# EAGLE design DoorchimeCR2 (EAGLE 6.5.0)

## Sheet 1 of 3
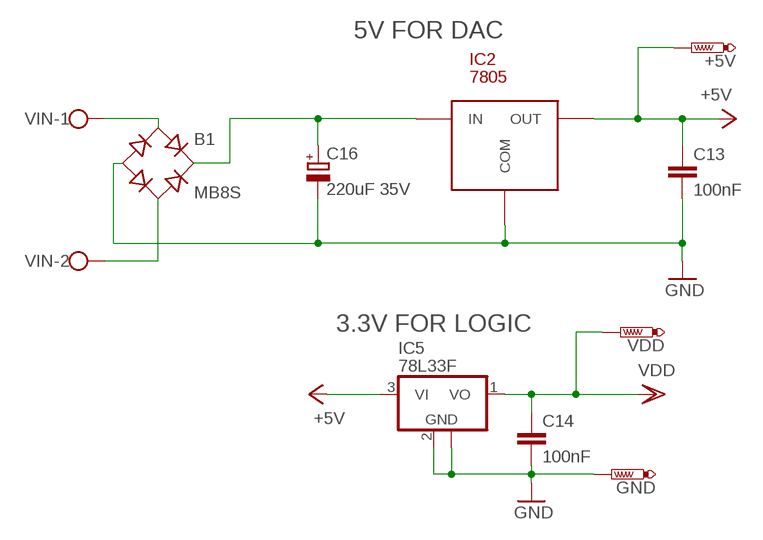
[diagram p0: schematic, sheet 1]

### Parts
+5V  PTR1TP15R  [TP15R]
B1  MB8S  [SOIC-4]
C13  100nF  C-EUC0603  [C0603]
C14  100nF  C-EUC0603  [C0603]
C16  220uF 35V  CPOL-EU153CLV-0807  [153CLV-0807]
GND  PTR1TP15R  [TP15R]
IC2  7805  78XX-D2PAK  [D2PAK]
IC5  78L33F  78L05F  [SOT89]
VDD  PTR1TP15R  [TP15R]
VIN  W237-102  [W237-102]

### Nets
+5V: +5V.TP C13.1 IC2.OUT IC5.3(VI) ; also sheet 3
GND [analog_pwr]: B1.- C13.2 C14.2 C16.- GND.TP IC2.COM IC5.2(GND) IC5.2@1(GND) ; also sheet 2,3
VDD: C14.1 IC5.1(VO) VDD.TP ; also sheet 2
VIN1 [system_pwr]: B1.~1(AC1) VIN.1
VIN2: B1.~2(AC2) VIN.2
VIN+: B1.+ C16.+ IC2.IN

### Notes on the sheet
- 5V FOR DAC
- 3.3V FOR LOGIC

## Sheet 2 of 3: Logic
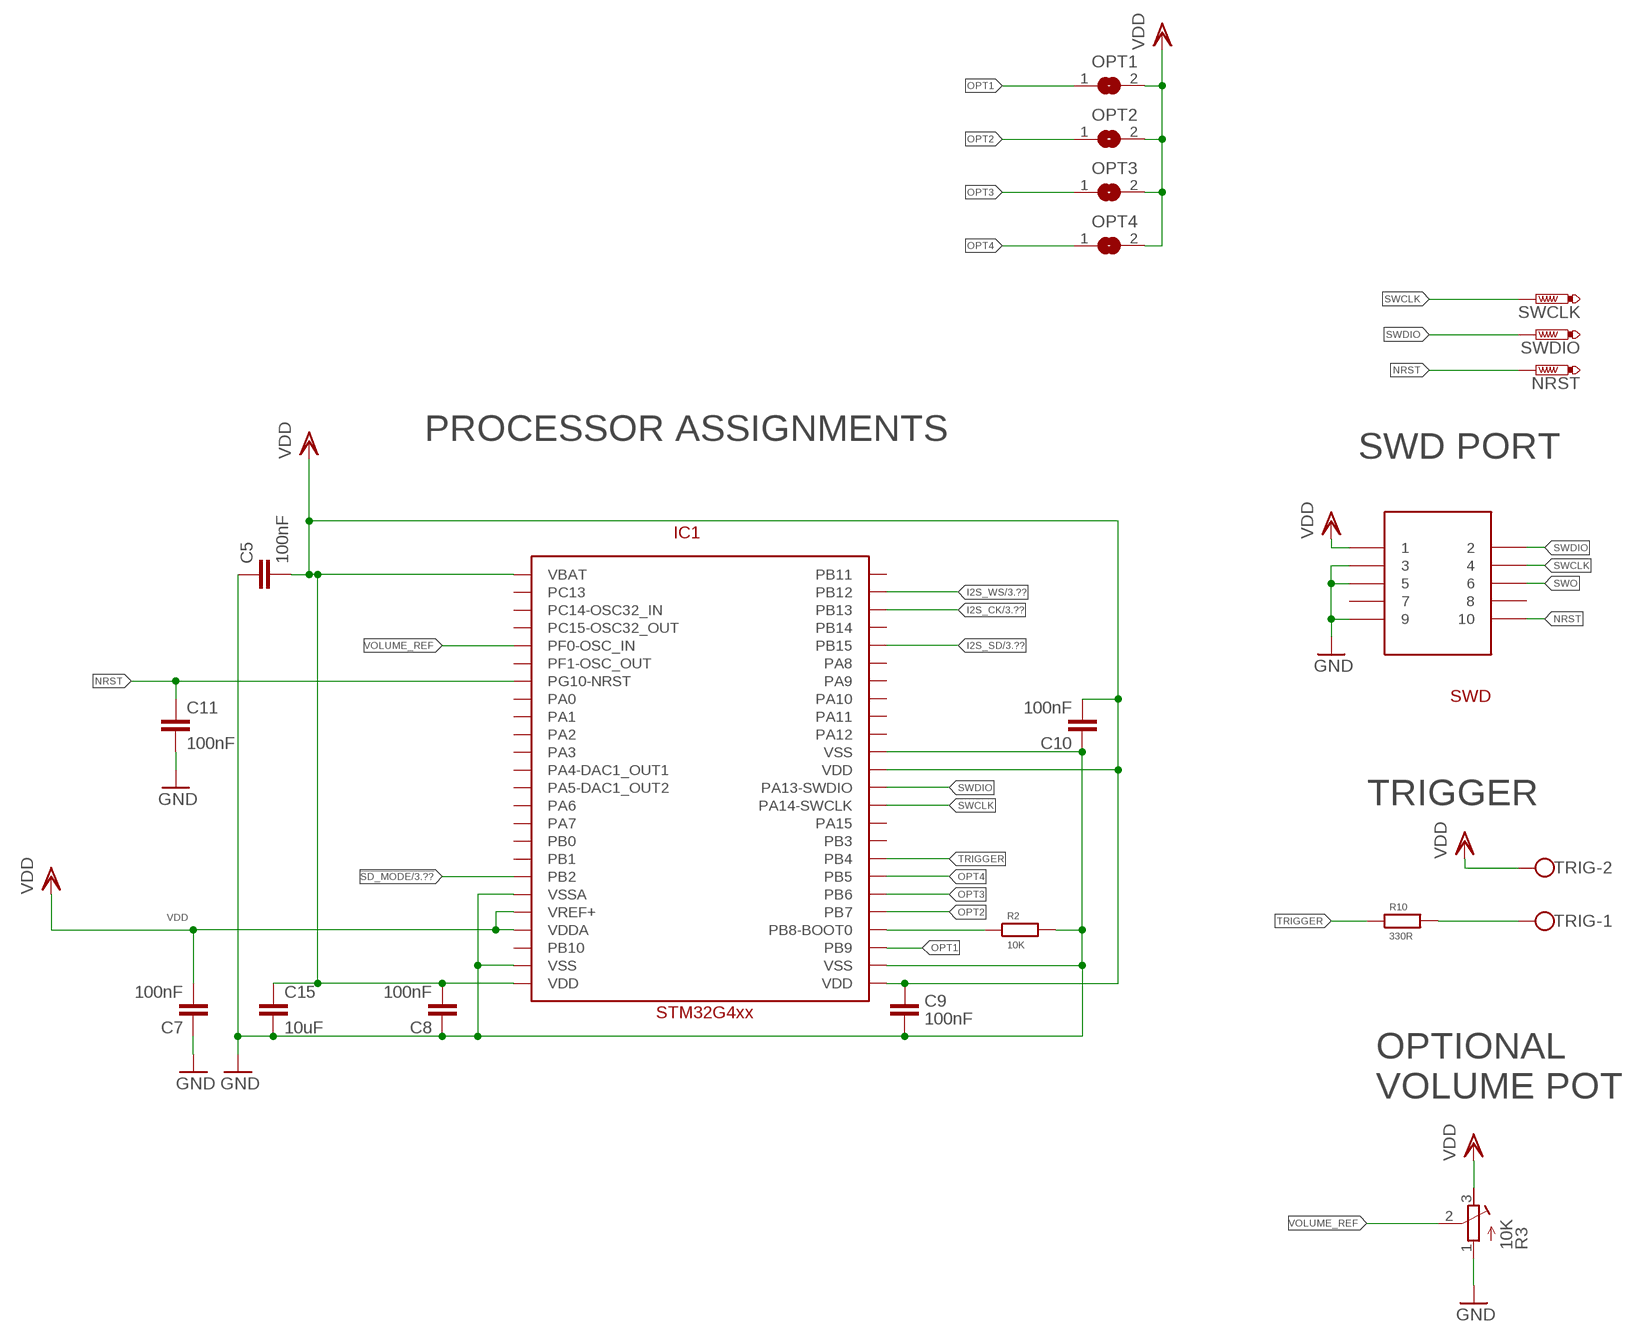
[diagram p1: schematic, sheet 2]

### Parts
C5  100nF  C-EUC0603  [C0603]
C7  100nF  C-EUC0603  [C0603]
C8  100nF  C-EUC0603  [C0603]
C9  100nF  C-EUC0603  [C0603]
C10  100nF  C-EUC0603  [C0603]
C11  100nF  C-EUC0603  [C0603]
C15  10uF  C-EUC0603  [C0603]
IC1  STM32G4xx  STM32G431-C8T6  [TQFP48]
NRST  PTR1TP15R  [TP15R]
OPT1  SJ  [SJ]
OPT2  SJ  [SJ]
OPT3  SJ  [SJ]
OPT4  SJ  [SJ]
R2  10K  R-EU_R0603  [R0603]
R3  10K  R-TRIMM3339P  [RTRIM3339P]
R10  330R  R-EU_R0603  [R0603]
SWCLK  PTR1TP15R  [TP15R]
SWD  FTSH-105-01  [FTSH-105-01-XXX-DV-K]
SWDIO  PTR1TP15R  [TP15R]
TRIG  W237-102  [W237-102]

### Nets
!SD_MODE: IC1.PB2 ; also sheet 3
BOOT0: IC1.PB8-BOOT0 R2.1
GND [analog_pwr]: C5.1 C7.1 C8.1 C9.1 C10.1 C11.2 C15.2 IC1.VSS@23(VSS) IC1.VSS@35(VSS) IC1.VSS@47(VSS) IC1.VSSA R2.2 R3.1(E) SWD.3 SWD.5 SWD.9 ; also sheet 1,3
I2S_CK: IC1.PB13 ; also sheet 3
I2S_SD: IC1.PB15 ; also sheet 3
I2S_WS: IC1.PB12 ; also sheet 3
NRST: C11.1 IC1.PG10-NRST NRST.TP SWD.10
OPT1: IC1.PB9 OPT1.1
OPT2: IC1.PB7 OPT2.1
OPT3: IC1.PB6 OPT3.1
OPT4: IC1.PB5 OPT4.1
SWCLK: IC1.PA14-SWCLK SWCLK.TP SWD.4
SWDIO: IC1.PA13-SWDIO SWD.2 SWDIO.TP
SWO: SWD.6
TRIG1: R10.2 TRIG.1
TRIGGER: IC1.PB4 R10.1
VDD: C5.2 C7.2 C8.2 C9.2 C10.2 C15.1 IC1.VBAT IC1.VDD@24(VDD) IC1.VDD@36(VDD) IC1.VDD@48(VDD) IC1.VDDA IC1.VREF+ OPT1.2 OPT2.2 OPT3.2 OPT4.2 R3.3(A) SWD.1 TRIG.2 ; also sheet 1
VOLUME_REF: IC1.PF0-OSC_IN R3.2(S)
Unconnected: IC1.PA0 IC1.PA1 IC1.PA2 IC1.PA3 IC1.PA4-DAC1_OUT1 IC1.PA5-DAC1_OUT2 IC1.PA6 IC1.PA7 IC1.PA8 IC1.PA9 IC1.PA10 IC1.PA11 IC1.PA12 IC1.PA15 IC1.PB0 IC1.PB1 IC1.PB3 IC1.PB10 IC1.PB11 IC1.PB14 IC1.PC13 IC1.PC14-OSC32_IN IC1.PC15-OSC32_OUT IC1.PF1-OSC_OUT SWD.7 SWD.8

### Notes on the sheet
- PROCESSOR ASSIGNMENTS
- SWD PORT
- TRIGGER
- OPTIONAL
  VOLUME POT

## Sheet 3 of 3: Speaker Output
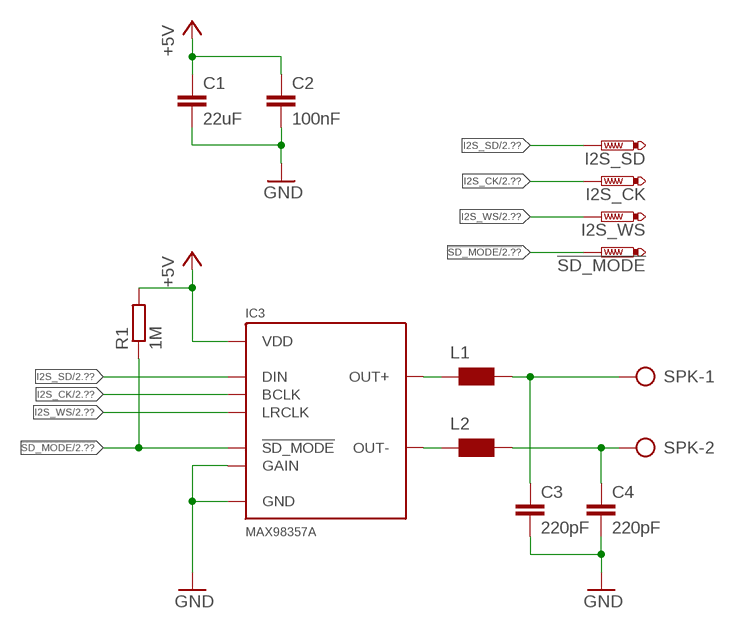
[diagram p2: schematic, sheet 3]

### Parts
!SD_MODE  PTR1TP15R  [TP15R]
C1  22uF  C-EUC0603  [C0603]
C2  100nF  C-EUC0603  [C0603]
C3  220pF  C-EUC0603  [C0603]
C4  220pF  C-EUC0603  [C0603]
I2S_CK  PTR1TP15R  [TP15R]
I2S_SD  PTR1TP15R  [TP15R]
I2S_WS  PTR1TP15R  [TP15R]
IC3  MAX98357A  [TQFN-16]
L1  WE-CBF_0603  [0603]
L2  WE-CBF_0603  [0603]
R1  1M  R-EU_R0603  [R0603]
SPK  W237-102  [W237-102]

### Nets
!SD_MODE: !SD_MODE.TP IC3.P$4(!SD_MODE) R1.1 ; also sheet 2
+5V: C1.1 C2.1 IC3.P$7(VDD) IC3.P$8(VDD) R1.2 ; also sheet 1
GND [analog_pwr]: C1.2 C2.2 C3.2 C4.2 IC3.P$2(GAIN) IC3.P$3(GND) IC3.P$11(GND) IC3.P$15(GND) IC3.P$EP(GND) ; also sheet 1,2
I2S_CK: I2S_CK.TP IC3.P$16(BCLK) ; also sheet 2
I2S_SD: I2S_SD.TP IC3.P$1(DIN) ; also sheet 2
I2S_WS: I2S_WS.TP IC3.P$14(LRCLK) ; also sheet 2
N$1 [system_pwr]: IC3.P$9(OUT+) L1.1
N$2 [system_pwr]: IC3.P$10(OUT-) L2.1
N$3 [system_pwr]: C4.1 L2.2 SPK.2
N$4 [system_pwr]: C3.1 L1.2 SPK.1

## Library data of the parts
!SD_MODE +5V GND I2S_CK I2S_SD I2S_WS NRST SWCLK SWDIO VDD = testpad:PTR1: TEST PIN
B1 = rectifier:MB*S: Bridge Rectifier Source: http://www.fairchildsemi.com/ds/MB/MB6S.pdf
C1-C5 C7-C11 C13-C15 = rcl:C-EU: CAPACITOR, European symbol
C16 = rcl:CPOL-EU: POLARIZED CAPACITOR, European symbol
IC1 = STM32G431:STM32G431-C8T6: STM32G431C8T6 64K of FLASH, 32K or RAM, 170MHz Cortex M4 with single precision floating point unit. Also, Two DACs.
IC2 = 78XXCD2T:78XX-D2PAK
IC3 = SparkFun-IC-Amplifiers:MAX98357A: I2S DAC 3.2W (4-8ohm); PROD_ID: IC-14032
IC5 = linear:78L*: POSITOIV-VOLTAGE REGULATORS Output up to 100 mA Source: http://focus.ti.com/lit/ds/symlink/ua78l05.pdf
L1 L2 = wuerth-elektronik:WE-CBF: SMD EMI Suppression Ferrite Beads - excellent anti-EMI properties - low DCR - impedances till 3000 ohms - rated current up to 6 A
OPT1-OPT4 = jumper:SJ: SMD solder JUMPER
R1 R2 R10 = rcl:R-EU_: RESISTOR, European symbol
R3 = rcl:R-TRIMM: Trimm resistor
SPK TRIG VIN = con-wago-500:W237-102: WAGO SCREW CLAMP; MPN: 237-102; OC_FARNELL: unknown; OC_NEWARK: 70K9898
SWD = Con-Samtech (Duncs):FTSH-105-01

## Net classes
0 sgnal: width 0.152 mm, clearance 0.152 mm
1 analog_pwr: width 0.152 mm, clearance 0.152 mm
2 analog_sig: width 0.152 mm, clearance 0.152 mm
3 system_pwr: width 0.152 mm, clearance 0.152 mm

## Board
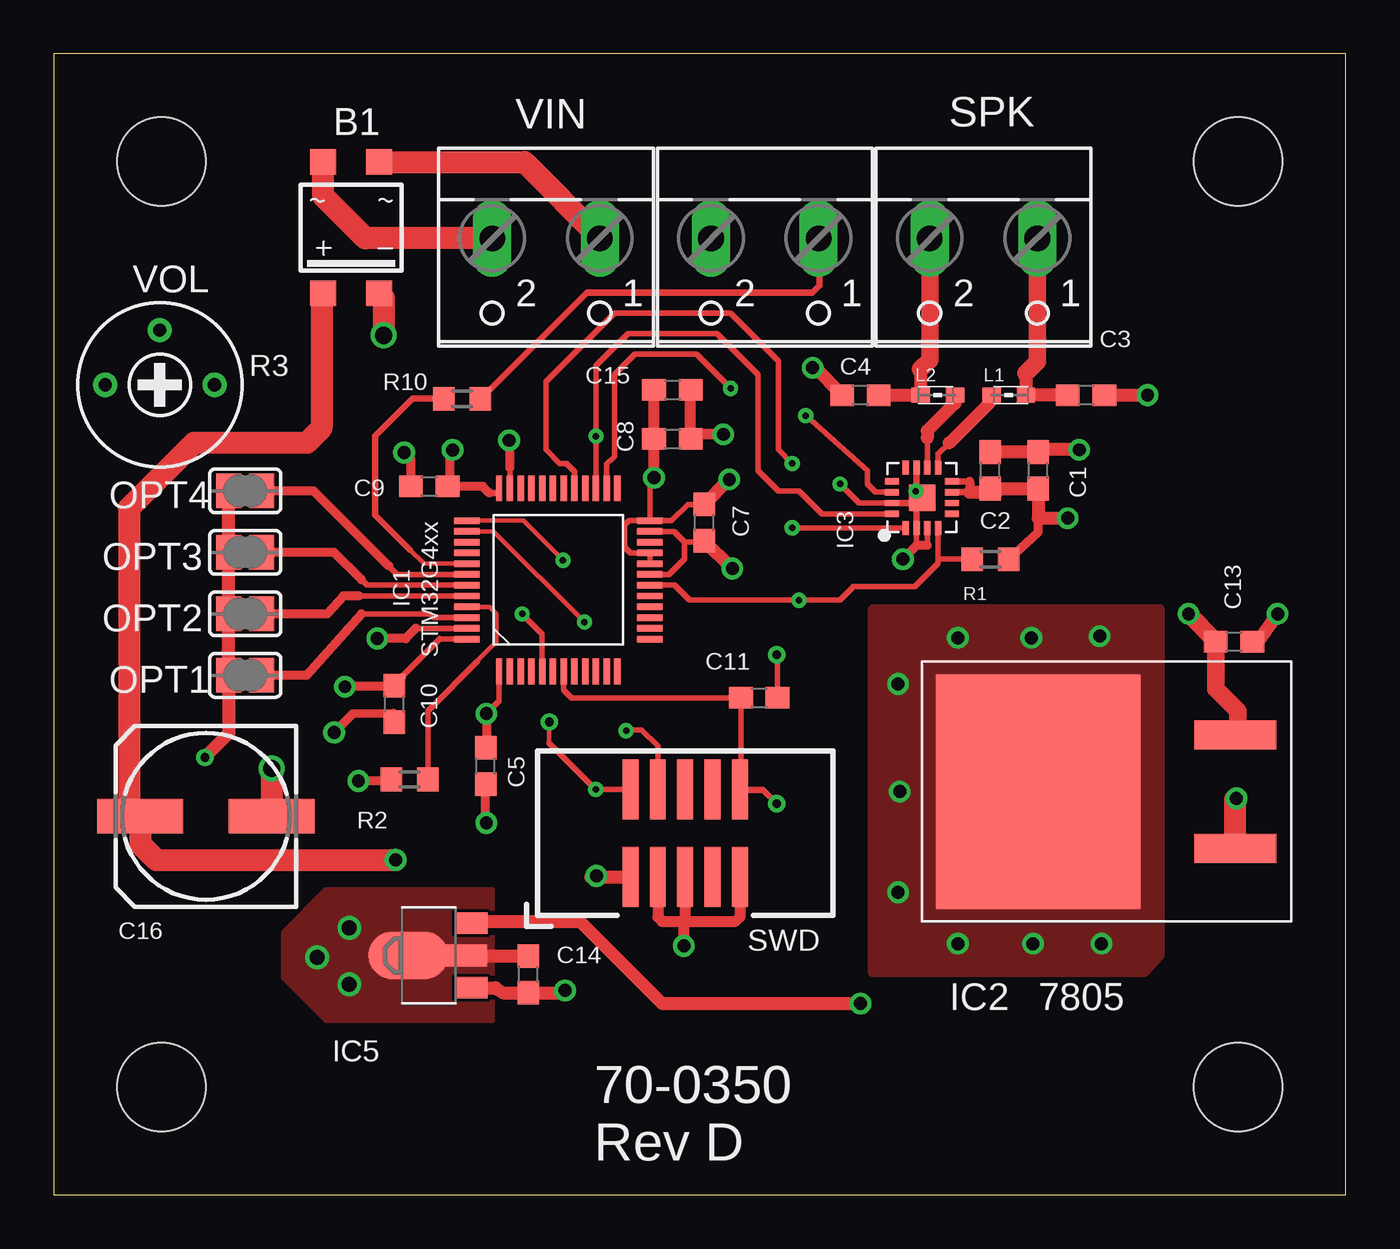
[diagram p3: board, top side]
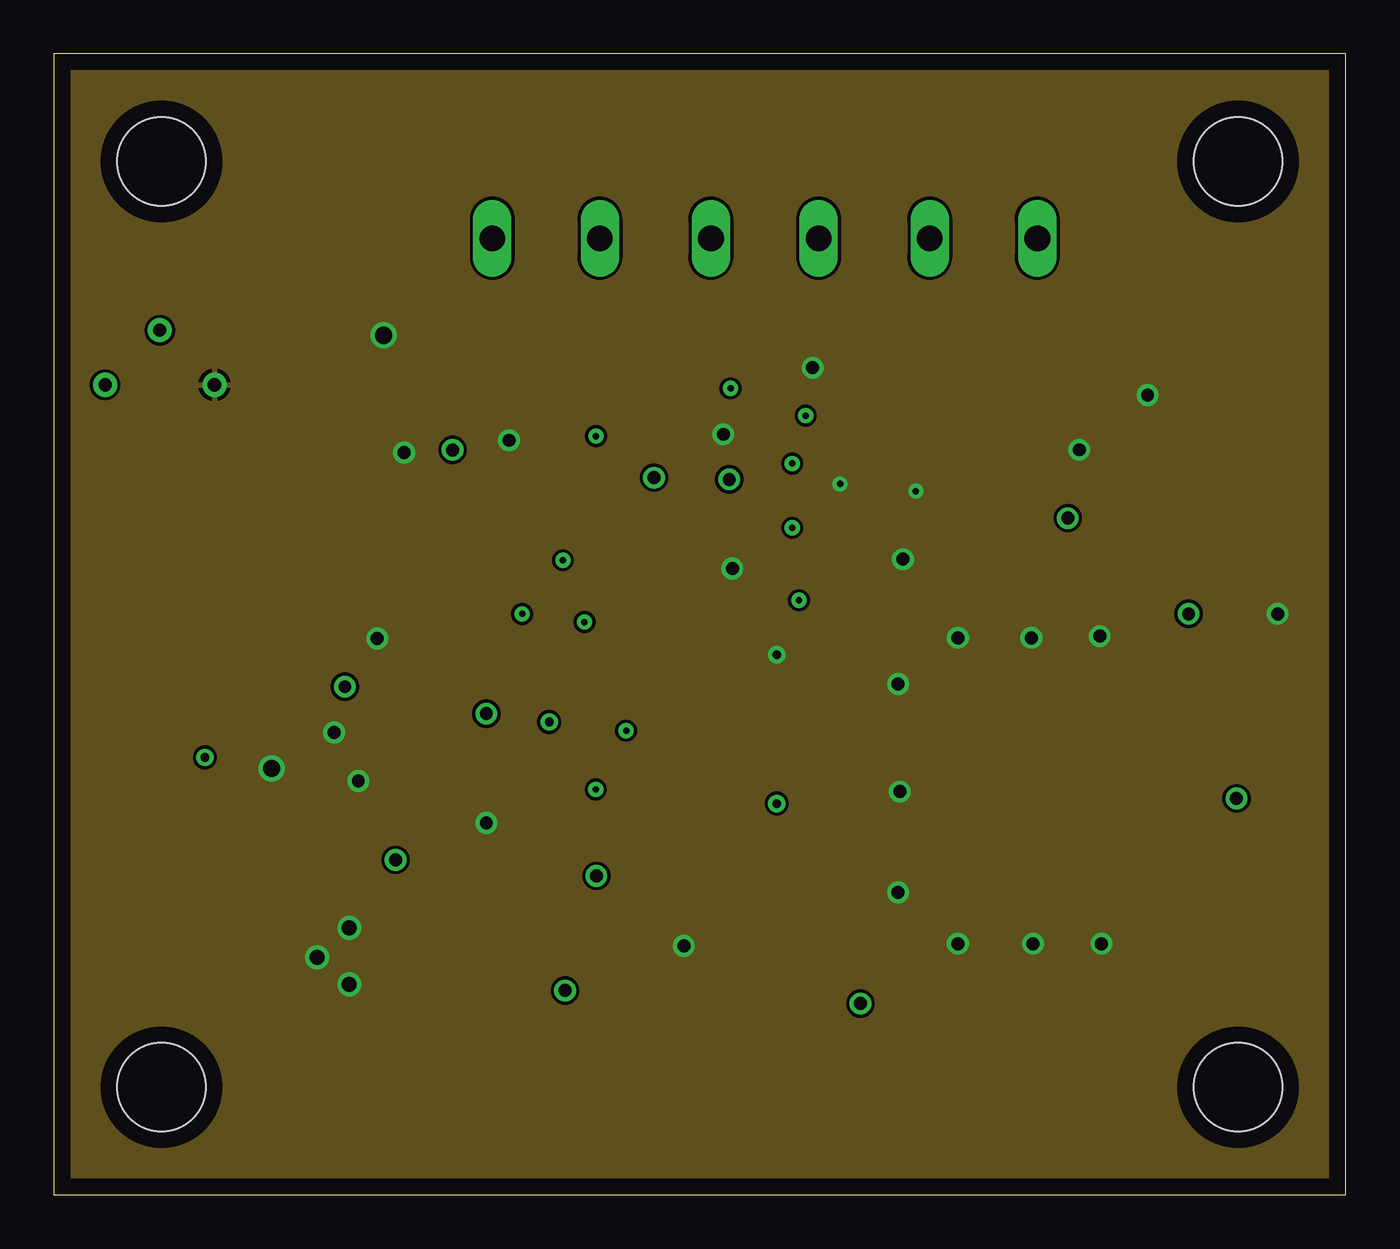
[diagram p4: board, inner layer Route2]
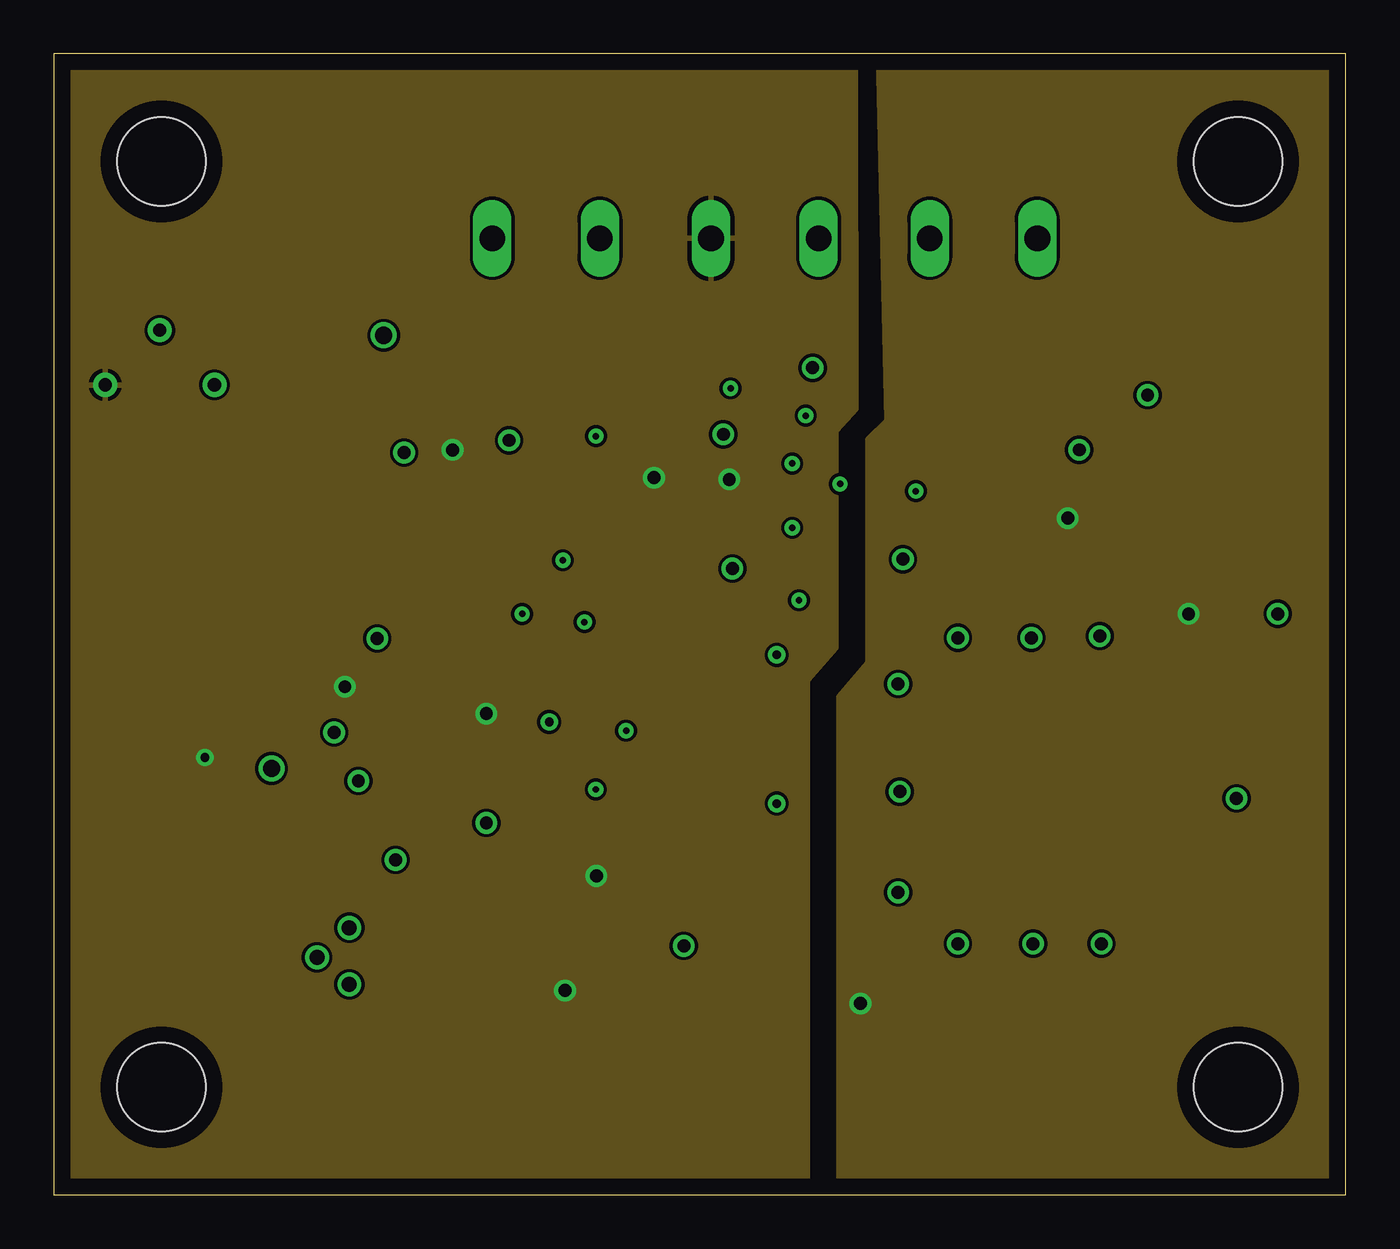
[diagram p5: board, inner layer Route15]
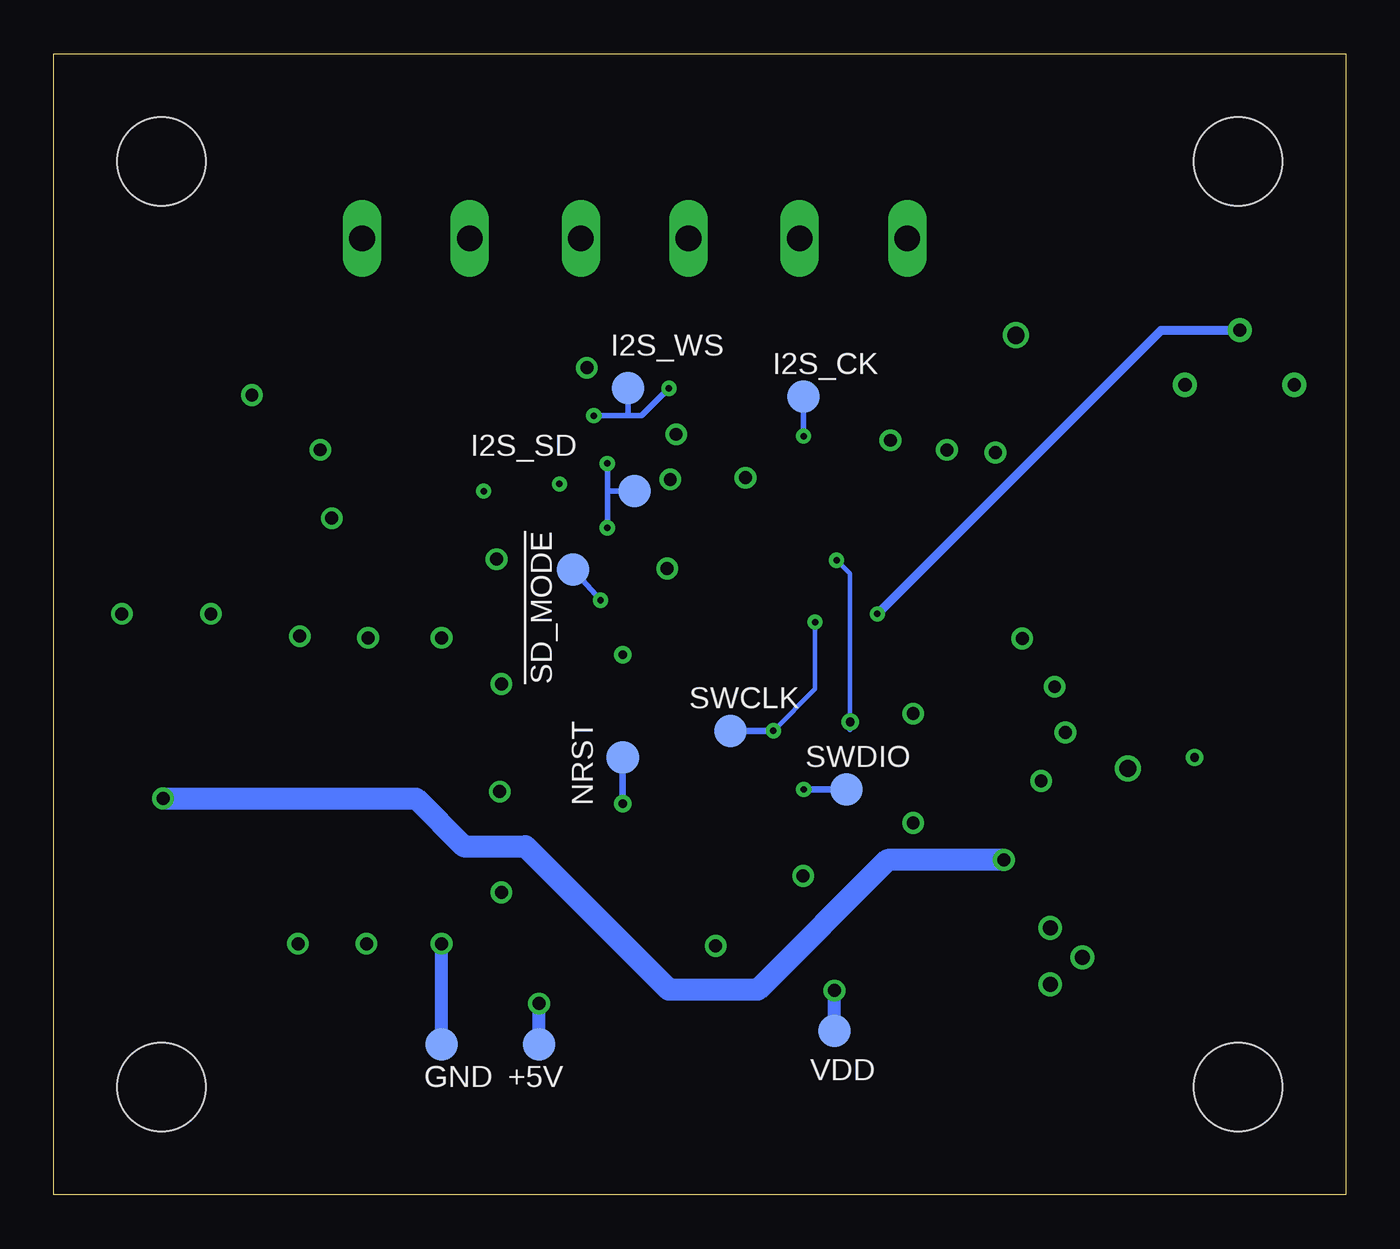
[diagram p6: board, bottom side, seen from below]

Size 60 x 53 mm. Coordinates in mm from the lower left corner, seen from the top.
Outline: 0,0 60,0 60,53 0,53 0,0
Copper layers ((1+2)*(15+16)): Top 0.035mm / dielectric 0.78mm / Route2 0.035mm / dielectric 0.1mm / Route15 0.035mm / dielectric 0.78mm / Bottom 0.035mm
Design rules "default *": minimum track width 6mil, minimum drill 0.25mm, track to track 3mil, track to pad 3mil, pad to pad 3mil, via to via 3mil, smd to smd 3mil, copper to edge 30mil, drill to drill 8mil, minimum pad ring 10mil, minimum via ring 8mil, stop-mask expansion 2.5mil, vias tented up to drill 0mil, thermal gap 8mil
Holes 4.1 mm at 5,5 55,5 55,48 5,48

### Footprints (pad centres in the part's own frame; a part is rotated, then mirrored left to right if it is on the bottom)
TP15R = smd 1.5 x 1.5: TP 0,0
SOIC-4 = smd 1.2 x 1.2: + 1.3,3.05; - -1.3,3.05; ~1 -1.3,-3.05; ~2 1.3,-3.05
C0603 = smd 1.1 x 1: 1 -0.85,0; 2 0.85,0
153CLV-0807 = smd 4 x 1.6: + 3.05,0; - -3.05,0
TQFP48 = smd 1.2 x 0.3: PA0 -4.25,-0.75; PA1 -4.25,-1.25; PA2 -4.25,-1.75; PA3 -4.25,-2.25; PA4-DAC1_OUT1 -4.25,-2.75; PA8 4.25,-0.25; PA9 4.25,0.25; PA10 4.25,0.75; PA11 4.25,1.25; PA12 4.25,1.75; PB11 4.25,-2.75; PB12 4.25,-2.25; PB13 4.25,-1.75; PB14 4.25,-1.25; PB15 4.25,-0.75; PC13 -4.25,2.25; PC14-OSC32_IN -4.25,1.75; PC15-OSC32_OUT -4.25,1.25; PF0-OSC_IN -4.25,0.75; PF1-OSC_OUT -4.25,0.25; PG10-NRST -4.25,-0.25; VBAT -4.25,2.75; VDD@36 4.25,2.75; VSS@35 4.25,2.25 | smd 0.3 x 1.2: PA5-DAC1_OUT2 -2.75,-4.25; PA6 -2.25,-4.25; PA7 -1.75,-4.25; PA13-SWDIO 2.75,4.25; PA14-SWCLK 2.25,4.25; PA15 1.75,4.25; PB0 -1.25,-4.25; PB1 -0.75,-4.25; PB2 -0.25,-4.25; PB3 1.25,4.25; PB4 0.75,4.25; PB5 0.25,4.25; PB6 -0.25,4.25; PB7 -0.75,4.25; PB8-BOOT0 -1.25,4.25; PB9 -1.75,4.25; PB10 1.75,-4.25; VDD@24 2.75,-4.25; VDD@48 -2.75,4.25; VDDA 1.25,-4.25; VREF+ 0.75,-4.25; VSS@23 2.25,-4.25; VSS@47 -2.25,4.25; VSSA 0.25,-4.25
D2PAK = smd 10.9 x 9.5: COM 0,0 | smd 1.35 x 3.81: IN -2.64,-9.15; OUT 2.64,-9.15
TQFN-16 = smd 0.3 x 0.65: P$1 -0.75,-1.4; P$2 -0.25,-1.4; P$3 0.25,-1.4; P$4 0.75,-1.4; P$9 0.75,1.4; P$10 0.25,1.4; P$11 -0.25,1.4; P$12 -0.75,1.4 | smd 0.65 x 0.3: P$5 1.4,-0.75; P$6 1.4,-0.25; P$7 1.4,0.25; P$8 1.4,0.75; P$13 -1.4,0.75; P$14 -1.4,0.25; P$15 -1.4,-0.25; P$16 -1.4,-0.75 | smd 1.23 x 1.23: P$EP 0,0
SOT89 = smd 1 x 1.5: 1 -1.499,-1.981; 3 1.499,-1.981 | smd 1 x 2: 2 0,-1.727 | smd 2.2 x 3.7: 2@1 0,0.94
0603 = smd 0.85 x 0.7: 1 -0.9,0; 2 0.7,0
SJ = smd 1.168 x 1.6: 1 -0.762,0; 2 0.762,0
R0603 = smd 1 x 1.1: 1 -0.85,0; 2 0.85,0
RTRIM3339P = drill 0.61: 1 -2.54,0; 2 0,-2.54; 3 2.54,0
W237-102 = drill 1.194 long: 1 -2.5,-1.27; 2 2.5,-1.27
FTSH-105-01-XXX-DV-K = smd 0.737 x 2.794: 1 -2.54,-2.032; 2 -2.54,2.032; 3 -1.27,-2.032; 4 -1.27,2.032; 5 0,-2.032; 6 0,2.032; 7 1.27,-2.032; 8 1.27,2.032; 9 2.54,-2.032; 10 2.54,2.032

### Placement (x,y rotation side)
!SD_MODE  35.88,29.05 0 bottom
+5V  37.47,6.99 0 bottom
B1  13.81,44.93 180 top
C1  45.72,33.66 90 top
C2  43.5,33.66 90 top
C3  47.94,37.15 0 top
C4  37.47,37.15 180 top
C5  20.06,19.93 90 top
C7  30.22,31.23 90 top
C8  28.73,35.11 180 top
C9  17.44,32.91 0 top
C10  15.82,22.8 90 top
C11  32.76,23.08 0 top
C13  54.81,25.7 0 top
C14  22.04,10.24 90 top
C15  28.73,37.39 0 top
C16  7.06,17.59 180 top
GND  41.99,6.99 0 bottom
I2S_CK  25.18,37.08 0 bottom
I2S_SD  33.02,32.7 0 bottom
I2S_WS  33.34,37.47 0 bottom
IC1  23.43,28.57 90 top
IC2  45.72,18.73 90 top
IC3  40.32,32.38 0 top
IC5  17.4,11.13 90 top
L1  44.45,37.15 0 top
L2  40.96,37.15 180 top
NRST  33.58,20.32 0 bottom
OPT1  8.89,24.13 180 top
OPT2  8.89,26.99 180 top
OPT3  8.89,29.84 180 top
OPT4  8.89,32.7 180 top
R1  43.5,29.53 0 top
R2  16.52,19.3 180 top
R3  4.92,37.62 180 top
R10  18.96,36.98 0 top
SPK  43.18,43.16 180 top
SWCLK  28.57,21.56 0 bottom
SWD  29.32,16.8 0 top
SWDIO  23.18,18.83 0 bottom
TRIG  33.02,43.16 180 top
VDD  23.74,7.62 0 bottom
VIN  22.86,43.16 180 top

### Tracks (layer width: path | path; a pad name or v marks a point on that pad's centre or on a via)
!SD_MODE  (via drill 0.3)
  Top 0.254: 41.07,30.36 IC3.P$4 41.07,29.53 | IC1.PB2 28.83,28.32 29.53,27.62 v34.61,27.62 36.51,27.62 37.15,28.26 40.01,28.26 41.07,29.32 41.07,29.53 | R1.1 41.07,29.53
  Bottom 0.254: !SD_MODE.TP v34.61,27.62
+5V  (via drill 0.6)
  Top 0.305: IC3.P$7 42.55,32.63 | 43.78,32.63 C2.1 | IC3.P$8 42.55,33.13
  Top 0.406: 42.55,33.13 42.55,32.63 | R1.2 45.72,30.8 45.72,31.43
  Top 0.61: 42.55,32.63 43.78,32.63 | C2.1 C1.1 45.72,31.43 v47.09,31.43 | IC5.3 19.46,12.7 24.45,12.7 28.26,8.89 v37.47,8.89
  Top 0.813: v52.7,26.99 53.94,25.72 C13.1 53.98,25.68 53.98,23.5 54.98,22.49 54.98,21.26
  Top 1.016: IC2.OUT 54.98,21.26
  Bottom 0.61: +5V.TP v37.47,8.89
  pour Route15: 60,0 60,53 38.27,53 38.67,35.96 37.8,35.12 37.8,24.73 36.44,23.14 36.44,0
BOOT0
  Top 0.203: IC1.PB8-BOOT0 20.23,27.32 20.57,26.98 20.57,25.71 19.69,24.82 19.69,24.8
  Top 0.254: 19.69,24.8 17.37,22.48 R2.1
GND  (via drill 0.3, 0.4, 0.6, 0.6 pad 0.35, 0.7, 0.8)
  Top 0.254: IC1.VSS@35 21.18,33.77 | IC1.VSS@47 16.81,26.32 | IC1.VSS@23 28.79,30.82 29.29,30.32 | 29.29,30.32 30.16,30.32 C7.1 30.23,30.36 | IC1.VSSA 28.58,28.82 29.29,29.53 29.29,30.32 | IC3.P$2 40.07,30.16 | IC3.P$3 40.57,30.16 | v33.58,25.08 33.61,25.05 C11.2 | IC3.P$15 37.4,32.13 v36.51,33.02
  Top 0.305: 15.61,19.36 R2.2 | 15.77,22.38 C10.1 | IC3.P$EP 40.07,32.38 IC3.P$2 | IC3.P$15 40.32,32.13 IC3.P$EP | IC3.P$EP 40.07,32.63 IC3.P$11
  Top 0.406: v13.02,21.48 13.89,22.36 15.77,22.38 | 21.18,33.77 21.18,34.39 v21.14,35.05 | 29.26,12.69 29.38,12.69 29.32,12.88 | 31.88,14.75 SWD.9 | v20.09,17.28 20.06,17.45 C5.1 | 15.61,19.36 15.49,19.23 v14.14,19.23 | 16.81,26.32 16.34,25.84 v15.02,25.84 | C9.1 16.59,34.16 v16.27,34.48 | 46.14,34.61 C1.2 | v39.44,29.53 40.07,30.16 40.57,30.16 | 35.34,38.42 v35.24,38.42
  Top 0.508: SWD.3 28.05,12.9 28.26,12.69 29.26,12.69 v29.26,11.57 | 29.38,12.69 31.63,12.69 31.88,12.94 31.88,14.75 | SWD.5 29.32,12.88 | v31.09,35.33 29.67,35.34 arc90 C8.1 C15.2
  Top 0.61: IC5.2@1 IC5.2 19.42,11.09 C14.2 | C13.2 55.74,25.82 55.96,25.72 v56.84,26.99 | v31.52,29.09 30.23,30.36 | C1.2 C2.2 | v47.62,34.61 46.14,34.61 | C4.2 35.34,38.42 | C3.2 v50.8,37.15
  Top 1.016: B1.- 15.32,41.67 v15.32,39.93 | v10.11,19.81 C16.-
  Bottom 0.61: GND.TP v41.99,11.67
  other vias: 13.72,12.41 12.22,11.03 13.72,9.78 39.21,14.05 45.48,11.67 48.66,11.67 45.4,25.88 41.99,25.88 39.29,18.73 39.21,23.73 48.58,25.96 40.04,32.69
  pour Route2: 0,53 60,53 60,0 0,0
  pour Top (no thermals): 20.35,14.17 12.65,14.17 10.67,12.18 10.67,10.11 12.68,8.1 20.35,8.1
  pour Top (no thermals): 38.02,27.23 51.37,27.23 51.37,11.11 50.64,10.32 38.02,10.32
I2S_CK  (via drill 0.3)
  Top 0.254: IC1.PB13 v25.18,35.24 25.18,38.51 26.67,40.01 30.8,40.01 32.7,38.1 32.7,33.66 33.66,32.7 34.61,32.7 35.67,31.64 IC3.P$16
  Bottom 0.254: I2S_CK.TP v25.18,35.24
I2S_SD  (via drill 0.3)
  Top 0.254: v34.29,33.97 33.66,34.61 33.66,38.73 31.43,40.96 26.04,40.96 22.86,37.78 22.86,34.61 23.5,33.97 23.81,33.97 24.18,33.61 IC1.PB15 | v34.29,30.98 IC3.P$1
  Bottom 0.254: v34.29,33.97 34.29,32.7 | 34.29,32.7 v34.29,30.98 | I2S_SD.TP 34.29,32.7
I2S_WS  (via drill 0.3)
  Top 0.254: 38.48,32.63 IC3.P$14 38.17,32.63 37.78,33.02 37.78,33.66 v34.92,36.2 | IC1.PB12 25.68,33.93 26.04,34.29 26.04,38.1 26.99,39.05 29.84,39.05 v31.43,37.47
  Bottom 0.254: v31.43,37.47 32.7,36.2 33.34,36.2 | 33.34,36.2 v34.92,36.2 | I2S_WS.TP 33.34,36.2
N$1
  Top 0.254: 43.5,37.09 L1.1 | IC3.P$9 41.07,34.41 41.59,34.92
  Top 0.61: 43.5,37.09 43.5,36.83 41.59,34.92
N$2
  Top 0.254: IC3.P$10 40.57,35.17
  Top 0.61: L2.1 41.86,36.78 40.57,35.49 40.57,35.17
N$3
  Top 0.61: C4.1 L2.2 40.26,38.35
  Top 0.813: 40.26,38.35 40.68,38.77 SPK.2
N$4
  Top 0.61: C3.1 L1.2 45.15,38.16
  Top 0.813: 45.15,38.16 45.68,38.7 SPK.1
NRST  (via drill 0.4)
  Top 0.254: IC1.PG10-NRST 23.68,23.45 24.04,23.08 C11.1 | 31.92,18.81 C11.1
  Top 0.305: v33.58,18.18 32.94,18.81 31.92,18.81 SWD.10 | C11.1
  Top 0.406: SWD.10 31.83,18.83
  Bottom 0.305: NRST.TP v33.58,18.18
OPT1
  Top 0.254: IC1.PB9 17.63,26.82 17.46,26.99 14.29,26.99
  Top 0.406: OPT1.1 11.75,24.13 14.29,26.99
OPT2
  Top 0.254: IC1.PB7 14.16,27.82
  Top 0.406: OPT2.1 12.7,26.99 13.46,27.82 14.16,27.82
OPT3
  Top 0.254: IC1.PB6 14.54,28.32 14.29,28.57
  Top 0.406: OPT3.1 13.02,29.84 14.29,28.57
OPT4
  Top 0.254: IC1.PB5 15.95,28.82 15.56,29.21
  Top 0.406: 15.56,29.21 12.06,32.7 OPT4.1
SWCLK  (via drill 0.3 pad 0.35)
  Top 0.203: IC1.PA14-SWCLK 20.43,30.82 v24.64,26.61
  Top 0.254: SWD.4 28.05,20.84 27.3,21.59 26.61,21.59 v26.58,21.56
  Bottom 0.203: v24.64,26.61 24.64,23.49 v26.58,21.56
  Bottom 0.305: SWCLK.TP v26.58,21.56
SWDIO  (via drill 0.3, 0.3 pad 0.35, 0.4 pad 0.35)
  Top 0.203: IC1.PA13-SWDIO 21.81,31.32 v23.64,29.48 | 23.01,20.99 v23.01,21.97
  Top 0.254: 23.01,20.99 v25.17,18.83 SWD.2
  Bottom 0.203: v23.64,29.48 23.02,28.86 23.02,21.64 | 23.02,21.64 | 23.02,21.64 v23.01,21.97
  Bottom 0.305: 23.02,21.64 arc90 v23.01,21.97 | SWDIO.TP v25.17,18.83
TRIG1
  Top 0.305: TRIG.1 35.56,44.39 35.56,42.23 35.24,41.91 24.77,41.91 20,37.15 19.98,37.15 R10.2
TRIGGER
  Top 0.203: IC1.PB4 17.19,29.32 16.53,29.98
  Top 0.305: R10.1 16.66,36.98 14.92,35.24 14.92,31.59 16.53,29.98
VDD  (via drill 0.4 pad 0.25, 0.6 pad 0.35)
  Top 0.203: 20.64,32.6 20.68,32.64 IC1.VDD@36
  Top 0.254: 17.92,25.82 IC1.VDD@48 | IC1.VDD@24 27.68,33.11 | IC1.VREF+ IC1.VDDA 26.78,29.82 26.51,30.08 26.51,31.11 26.71,31.32 IC1.VDD@24 | IC1.VDD@24 28.7,31.32 29.45,32.07 30.21,32.07 C7.2 | IC1.VBAT 20.68,22.95 v20.09,22.36
  Top 0.305: C10.2 15.64,23.61 | 17.92,25.82 16.14,24.03 | 20.64,32.6 20.22,32.6 | 27.68,33.11 arc-90 v27.88,33.31
  Top 0.406: 26.76,14.75 SWD.1 | 15.64,23.61 v13.52,23.61 | 16.14,24.03 C10.2 | 20.22,32.6 19.92,32.91 C9.2 18.39,33.14 18.39,34.48 v18.52,34.6 | v20.09,22.36 20.09,20.8 C5.2
  Top 0.508: v27.88,33.31 27.88,35.42 arc90 C8.2 C15.1
  Top 0.61: IC5.1 20.5,9.63 20.86,9.39 C14.1 23.64,9.39 v23.74,9.49 | v25.2,14.82 24.93,14.77 SWD.1 | 31.35,33.18 31.32,33.18 C7.2 | OPT4.2 OPT3.2 OPT2.2 OPT1.2 8.13,21.43 v7.02,20.32
  Bottom 0.61: VDD.TP v23.74,9.49
  other vias: 31.37,33.23
  pour Route15: 37.25,53 37.28,36.5 36.36,35.47 36.36,25.39 35.02,23.89 35.02,-0.03 0,0 0,53
VIN1
  Top 1.016: B1.~1 21.85,47.98 VIN.1
  Bottom 0.508: VIN.1 25.32,44.5
VIN2
  Top 1.016: B1.~2 12.51,46.38 14.46,44.43 VIN.2
VIN+  (via drill 0.6)
  Top 1.016: B1.+ 12.43,41.8 12.43,35.61 11.75,34.92 6.51,34.92 3.49,31.91 3.49,17.79 C16.+ | IC2.IN 54.87,18.36 v54.93,18.41 | 3.89,17.71 C16.+ | C16.+ 4.01,16.31 4.76,15.56 v15.88,15.56
  Bottom 1.016: v54.93,18.41 43.18,18.41 40.96,16.19 38.1,16.19 31.43,9.53 27.3,9.53 21.27,15.56 v15.88,15.56
VOLUME_REF  (via drill 0.3)
  Top 0.254: IC1.PF0-OSC_IN 22.68,26.06 v21.75,26.99
  Bottom 0.406: v21.75,26.99 8.57,40.16 R3.2

### Text on the board
tNames: VOL | 70-0350 / Rev D
tValues: + | -